# Altium schematic sheet VIDEO.SchDoc: OCULUS RIFT DEVELOPMENT KIT 2 (DK2) MAIN BOARD
size B; Date: 12 MAR 2014; Author: L. BAINBRIDGE; CompanyName: Oculus VR, Inc.; DrawnBy: L. BAINBRIDGE; Engineer: L. BAINBRIDGE; Organization: Oculus VR, Inc.; DocumentNumber: 1; Revision: 3.3; SheetNumber: 1; SheetTotal: 6; PageSetup: Record=PageOptions|CenterHorizontal=True|CenterVertical=True|PrintScale=1.12|XCorrection=1.00|YCorrection=1.00|PrintKind=1|BorderSize=5000000|LeftOffset=0|BottomOffset=0|Orientation=2|PaperLength=1000|PaperWidth=1000|Scale=100|PaperSource=15|PrintQuality=1200|MediaType=1|DitherType=0|PaperKind=11 x 17|PrintScaleMode=1; SheetDescription: VIDEO HDMI RX TO MIPI DSI TX BRIDGE AND SUPPORTING CIRCUITS; PartNumber: N/A; ProjectName: DK2
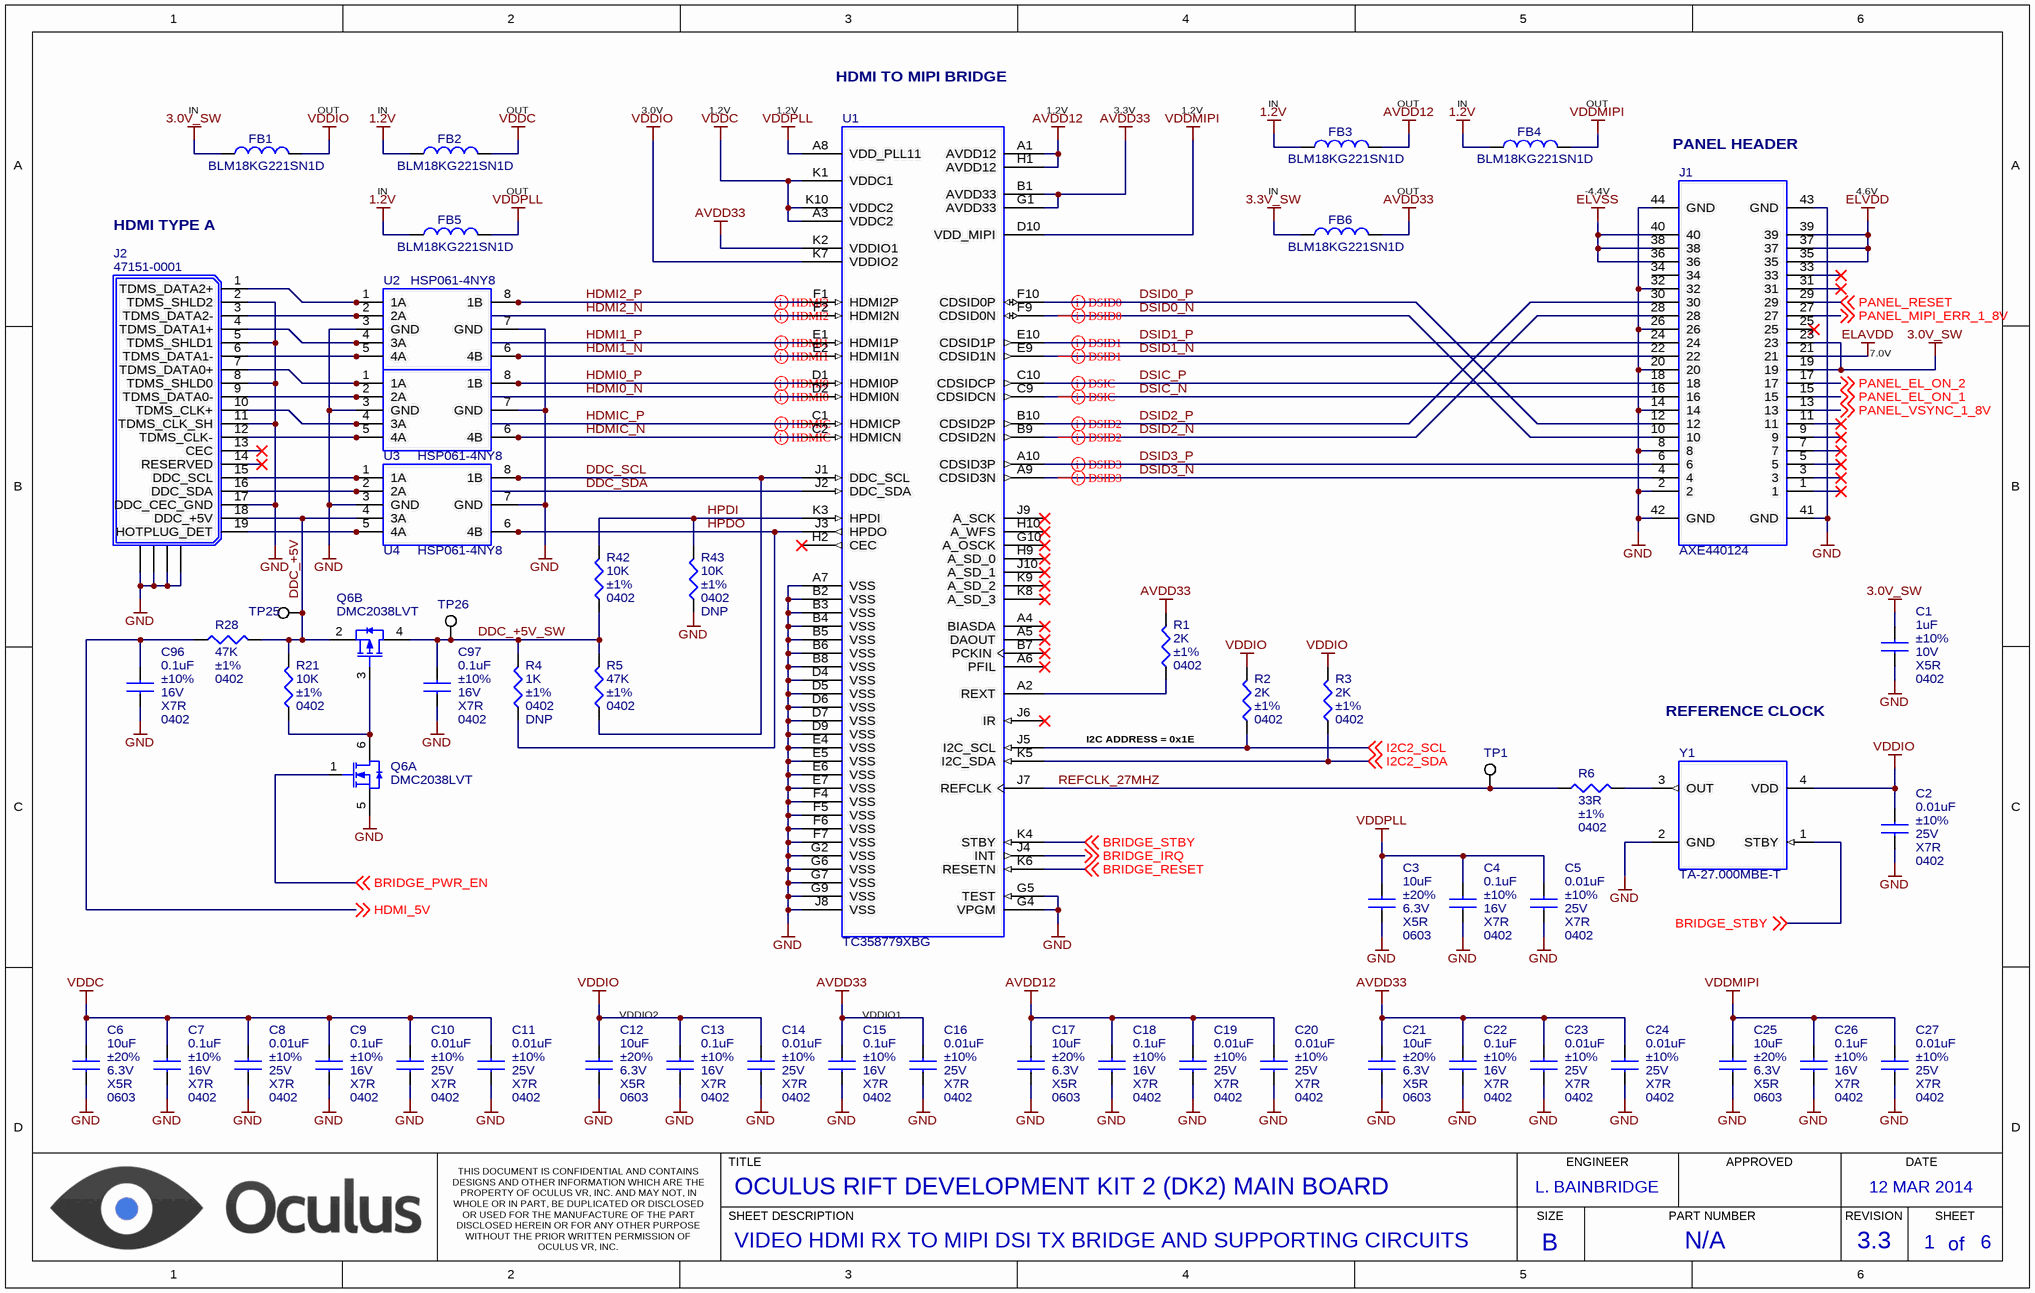
[diagram p0: VIDEO.SchDoc]

## Parts
C1  1uF  Tolerance: ±10%  Voltage: 10V  Dielectric: X5R  Package: 0402  [CAP_CERAMIC_0402]
C2  0.01uF  Tolerance: ±10%  Voltage: 25V  Dielectric: X7R  Package: 0402  [CAP_CERAMIC_0402]
C3  10uF  Tolerance: ±20%  Voltage: 6.3V  Dielectric: X5R  Package: 0603  [CAP_CERAMIC_0603]
C4  0.1uF  Tolerance: ±10%  Voltage: 16V  Dielectric: X7R  Package: 0402  [CAP_CERAMIC_0402]
C5  0.01uF  Tolerance: ±10%  Voltage: 25V  Dielectric: X7R  Package: 0402  [CAP_CERAMIC_0402]
C6  10uF  Tolerance: ±20%  Voltage: 6.3V  Dielectric: X5R  Package: 0603  [CAP_CERAMIC_0603]
C7  0.1uF  Tolerance: ±10%  Voltage: 16V  Dielectric: X7R  Package: 0402  [CAP_CERAMIC_0402]
C8  0.01uF  Tolerance: ±10%  Voltage: 25V  Dielectric: X7R  Package: 0402  [CAP_CERAMIC_0402]
C9  0.1uF  Tolerance: ±10%  Voltage: 16V  Dielectric: X7R  Package: 0402  [CAP_CERAMIC_0402]
C10  0.01uF  Tolerance: ±10%  Voltage: 25V  Dielectric: X7R  Package: 0402  [CAP_CERAMIC_0402]
C11  0.01uF  Tolerance: ±10%  Voltage: 25V  Dielectric: X7R  Package: 0402  [CAP_CERAMIC_0402]
C12  10uF  Tolerance: ±20%  Voltage: 6.3V  Dielectric: X5R  Package: 0603  [CAP_CERAMIC_0603]
C13  0.1uF  Tolerance: ±10%  Voltage: 16V  Dielectric: X7R  Package: 0402  [CAP_CERAMIC_0402]
C14  0.01uF  Tolerance: ±10%  Voltage: 25V  Dielectric: X7R  Package: 0402  [CAP_CERAMIC_0402]
C15  0.1uF  Tolerance: ±10%  Voltage: 16V  Dielectric: X7R  Package: 0402  [CAP_CERAMIC_0402]
C16  0.01uF  Tolerance: ±10%  Voltage: 25V  Dielectric: X7R  Package: 0402  [CAP_CERAMIC_0402]
C17  10uF  Tolerance: ±20%  Voltage: 6.3V  Dielectric: X5R  Package: 0603  [CAP_CERAMIC_0603]
C18  0.1uF  Tolerance: ±10%  Voltage: 16V  Dielectric: X7R  Package: 0402  [CAP_CERAMIC_0402]
C19  0.01uF  Tolerance: ±10%  Voltage: 25V  Dielectric: X7R  Package: 0402  [CAP_CERAMIC_0402]
C20  0.01uF  Tolerance: ±10%  Voltage: 25V  Dielectric: X7R  Package: 0402  [CAP_CERAMIC_0402]
C21  10uF  Tolerance: ±20%  Voltage: 6.3V  Dielectric: X5R  Package: 0603  [CAP_CERAMIC_0603]
C22  0.1uF  Tolerance: ±10%  Voltage: 16V  Dielectric: X7R  Package: 0402  [CAP_CERAMIC_0402]
C23  0.01uF  Tolerance: ±10%  Voltage: 25V  Dielectric: X7R  Package: 0402  [CAP_CERAMIC_0402]
C24  0.01uF  Tolerance: ±10%  Voltage: 25V  Dielectric: X7R  Package: 0402  [CAP_CERAMIC_0402]
C25  10uF  Tolerance: ±20%  Voltage: 6.3V  Dielectric: X5R  Package: 0603  [CAP_CERAMIC_0603]
C26  0.1uF  Tolerance: ±10%  Voltage: 16V  Dielectric: X7R  Package: 0402  [CAP_CERAMIC_0402]
C27  0.01uF  Tolerance: ±10%  Voltage: 25V  Dielectric: X7R  Package: 0402  [CAP_CERAMIC_0402]
C96  0.1uF  Tolerance: ±10%  Voltage: 16V  Dielectric: X7R  Package: 0402  [CAP_CERAMIC_0402]
C97  0.1uF  Tolerance: ±10%  Voltage: 16V  Dielectric: X7R  Package: 0402  [CAP_CERAMIC_0402]
FB1  BLM18KG221SN1D  [INDUCTOR_0603]
FB2  BLM18KG221SN1D  [INDUCTOR_0603]
FB3  BLM18KG221SN1D  [INDUCTOR_0603]
FB4  BLM18KG221SN1D  [INDUCTOR_0603]
FB5  BLM18KG221SN1D  [INDUCTOR_0603]
FB6  BLM18KG221SN1D  [INDUCTOR_0603]
J1  AXE440124  [AXE440124]
J2  47151-0001  [47151-0001]
Q6  DMC2038LVT  [TSOT26]  (parts A,B of 2)
R1  2K  Package: 0402  Tolerance: ±1%  [RESISTOR_0402]
R2  2K  Package: 0402  Tolerance: ±1%  [RESISTOR_0402]
R3  2K  Package: 0402  Tolerance: ±1%  [RESISTOR_0402]
R4  1K  Package: 0402  Tolerance: ±1%  [RESISTOR_0402]  (no BOM)
R5  47K  Package: 0402  Tolerance: ±1%  [RESISTOR_0402]
R6  33R  Package: 0402  Tolerance: ±1%  [RESISTOR_0402]
R21  10K  Package: 0402  Tolerance: ±1%  [RESISTOR_0402]
R28  47K  Package: 0402  Tolerance: ±1%  [RESISTOR_0402]
R42  10K  Package: 0402  Tolerance: ±1%  [RESISTOR_0402]
R43  10K  Package: 0402  Tolerance: ±1%  [RESISTOR_0402]  (no BOM)
TP1  TEST POINT  [TEST_POINT_PAD_1MM]  (value not drawn)  (no BOM)
TP25  TEST POINT  [TEST_POINT_PAD_1MM]  (value not drawn)  (no BOM)
TP26  TEST POINT  [TEST_POINT_PAD_1MM]  (value not drawn)  (no BOM)
U1  TC358779XBG  [BGA80]
U2  HSP061-4NY8  [HSP061-4NY8]
U3  HSP061-4NY8  [HSP061-4NY8]
U4  HSP061-4NY8  [HSP061-4NY8]
Y1  TA-27.000MBE-T  [TXC_TD]

## Nets
1.2V: FB2.1 FB3.1 FB4.1 FB5.1
3.0V_SW: C1.1 FB1.1 J1.19 J1.23
3.3V_SW: FB6.1
AVDD12: C17.1 C18.1 C19.1 C20.1 FB3.2 U1.A1(AVDD12) U1.H1(AVDD12)
AVDD33: C15.1 C16.1 C21.1 C22.1 C23.1 C24.1 FB6.2 R1.2 U1.B1(AVDD33) U1.G1(AVDD33) U1.K2(VDDIO1)
ELAVDD: J1.21
ELVDD: J1.35 J1.37 J1.39
ELVSS: J1.36 J1.38 J1.40
GND: C1.2 C2.2 C3.2 C4.2 C5.2 C6.2 C7.2 C8.2 C9.2 C10.2 C11.2 C12.2 C13.2 C14.2 C15.2 C16.2 C17.2 C18.2 C19.2 C20.2 C21.2 C22.2 C23.2 C24.2 C25.2 C26.2 C27.2 C96.2 C97.2 J1.2 J1.8 J1.14 J1.20 J1.26 J1.32 J1.41(GND) J1.42(GND) J1.43(GND) J1.44(GND) J2.2(TDMS_SHLD2) J2.5(TDMS_SHLD1) J2.8(TDMS_SHLD0) J2.11(TDMS_CLK_SH) J2.17(DDC_CEC_GND) J2.20(SHIELD) J2.21(SHIELD) J2.22(SHIELD) J2.23(SHIELD) Q6.5(S) R43.1 U1.A7(VSS) U1.B2(VSS) U1.B3(VSS) U1.B4(VSS) U1.B5(VSS) U1.B6(VSS) U1.B8(VSS) U1.D4(VSS) U1.D5(VSS) U1.D6(VSS) U1.D7(VSS) U1.D9(VSS) U1.E4(VSS) U1.E5(VSS) U1.E6(VSS) U1.E7(VSS) U1.F4(VSS) U1.F5(VSS) U1.F6(VSS) U1.F7(VSS) U1.G2(VSS) U1.G4(VPGM) U1.G5(TEST) U1.G6(VSS) U1.G7(VSS) U1.G9(VSS) U1.J8(VSS) U2.3(GND) U2.7(GND) U3.3(GND) U3.7(GND) U4.3(GND) U4.7(GND) Y1.2(GND)
VDDC: C6.1 C7.1 C8.1 C9.1 C10.1 C11.1 FB2.2 U1.A3(VDDC2) U1.K1(VDDC1) U1.K10(VDDC2)
VDDIO: C2.1 C12.1 C13.1 C14.1 FB1.2 R2.2 R3.2 U1.K7(VDDIO2) Y1.4(VDD)
VDDMIPI: C25.1 C26.1 C27.1 FB4.2 U1.D10(VDD_MIPI)
VDDPLL: C3.1 C4.1 C5.1 FB5.2 U1.A8(VDD_PLL11)
BRIDGE_IRQ: U1.J4(INT) ; off-sheet BRIDGE_IRQ
BRIDGE_PWR_EN: Q6.1(G) ; off-sheet BRIDGE_PWR_EN
BRIDGE_RESET: U1.K6(RESETN) ; off-sheet BRIDGE_RESET
BRIDGE_STBY: U1.K4(STBY) Y1.1(STBY) ; off-sheet BRIDGE_STBY
DDC_+5V: J2.18(DDC_+5V) Q6.2(S) R21.2 R28.2 TP25.1 U4.4(3A)
DDC_+5V_SW: C97.1 Q6.4(D) R4.2 R5.2 R42.1 TP26.1
DDC_SCL: J2.15(DDC_SCL) R5.1 U1.J1(DDC_SCL) U4.1(1A) U4.8(1B)
DDC_SDA: J2.16(DDC_SDA) U1.J2(DDC_SDA) U4.2(2A)
DSIC_N: J1.16 U1.C9(CDSIDCN)
DSIC_P: J1.18 U1.C10(CDSIDCP)
DSID0_N: J1.10 U1.F9(CDSID0N)
DSID0_P: J1.12 U1.F10(CDSID0P)
DSID1_N: J1.22 U1.E9(CDSID1N)
DSID1_P: J1.24 U1.E10(CDSID1P)
DSID2_N: J1.28 U1.B9(CDSID2N)
DSID2_P: J1.30 U1.B10(CDSID2P)
DSID3_N: J1.4 U1.A9(CDSID3N)
DSID3_P: J1.6 U1.A10(CDSID3P)
HDMI0_N: J2.9(TDMS_DATA0-) U1.D2(HDMI0N) U3.2(2A)
HDMI0_P: J2.7(TDMS_DATA0+) U1.D1(HDMI0P) U3.1(1A) U3.8(1B)
HDMI1_N: J2.6(TDMS_DATA1-) U1.E2(HDMI1N) U2.5(4A) U2.6(4B)
HDMI1_P: J2.4(TDMS_DATA1+) U1.E1(HDMI1P) U2.4(3A)
HDMI2_N: J2.3(TDMS_DATA2-) U1.F2(HDMI2N) U2.2(2A)
HDMI2_P: J2.1(TDMS_DATA2+) U1.F1(HDMI2P) U2.1(1A) U2.8(1B)
HDMI_5V: C96.1 R28.1 ; off-sheet HDMI_5V
HDMIC_N: J2.12(TDMS_CLK-) U1.C2(HDMICN) U3.5(4A) U3.6(4B)
HDMIC_P: J2.10(TDMS_CLK+) U1.C1(HDMICP) U3.4(3A)
HPDI: R42.2 R43.2 U1.K3(HPDI)
HPDO: J2.19(HOTPLUG_DET) R4.1 U1.J3(HPDO) U4.5(4A) U4.6(4B)
I2C2_SCL: R2.1 U1.J5(I2C_SCL) ; off-sheet I2C2_SCL
I2C2_SDA: R3.1 U1.K5(I2C_SDA) ; off-sheet I2C2_SDA
PANEL_EL_ON_1: J1.15 ; off-sheet PANEL_EL_ON_1
PANEL_EL_ON_2: J1.17 ; off-sheet PANEL_EL_ON_2
PANEL_MIPI_ERR_1_8V: J1.27 ; off-sheet PANEL_MIPI_ERR_1_8V
PANEL_RESET: J1.29 ; off-sheet PANEL_RESET
PANEL_VSYNC_1_8V: J1.13 ; off-sheet PANEL_VSYNC_1_8V
REFCLK_27MHZ: R6.1 TP1.1 U1.J7(REFCLK)
NetQ6_3: Q6.3(G) Q6.6(D) R21.1
NetR1_1: R1.1 U1.A2(REXT)
NetR6_2: R6.2 Y1.3(OUT)

Not connected (* = marked no-connect by the designer): J1 1* 3* 5* 7* 9* 11* 25* 31* 33* 34; J2 13(CEC)* 14(RESERVED)*; U1 A4(BIASDA)* A5(DAOUT)* A6(PFIL)* B7(PCKIN)* G10(A_OSCK)* H2(CEC)* H9(A_SD_0)* H10(A_WFS)* J6(IR)* J9(A_SCK)* J10(A_SD_1)* K8(A_SD_3)* K9(A_SD_2)*

## Layout directives
differential pair: DSIC_N, DSIC_P, DSID0_N, DSID0_P, DSID1_N, DSID1_P, DSID2_N, DSID2_P, DSID3_N, DSID3_P, HDMI0_N, HDMI0_P, HDMI1_N, HDMI1_P, HDMI2_N, HDMI2_P, HDMIC_N, HDMIC_P

## Notes on the sheet
- HDMI TO MIPI BRIDGE
- (near FB3) IN
- (near FB3) OUT
- (near FB4) IN
- (near FB4) OUT
- (near FB1) IN
- (near FB1) OUT
- (near FB2) IN
- (near FB2) OUT
- 3.0V
- 1.2V
- 3.3V
- PANEL HEADER
- HDMI TYPE A
- IN
- OUT
- -4.4V
- 4.6V
- 7.0V
- (near R2) I2C ADDRESS = 0x1E
- REFERENCE CLOCK
- VDDIO2
- VDDIO1
- TITLE
- ENGINEER
- APPROVED
- DATE
- THIS DOCUMENT IS CONFIDENTIAL AND CONTAINS DESIGNS AND OTHER INFORMATION WHICH ARE THE PROPERTY OF OCULUS VR, INC. AND MAY NOT, IN WHOLE OR IN PART, BE DUPLICATED OR DISCLOSED OR USED FOR THE MANUFACTURE OF THE PART DISCLOSED HEREIN OR FOR ANY OTHER PURPOSE WITHOUT THE PRIOR WRITTEN PERMISSION OF OCULUS VR, INC.
- SHEET DESCRIPTION
- SIZE
- PART NUMBER
- REVISION
- SHEET
- of
- B

## Library data of the parts
C1 = CAP, CERAMIC: CAP, CERAMIC, 1uF, ±10%, 10V, X5R, 0402; Manufacturer: MURATA ELECTRONICS; Part Number: GRM155R61A105KE15D
C2 C5 C8 C10 C11 C14 C16 C19 C20 C23 C24 C27 = CAP, CERAMIC: CAP, CERAMIC, 0.01uF, ±10%, 25V, X7R, 0402; Manufacturer: MURATA ELECTRONICS; Part Number: GRM155R71E103KA01D
C3 C6 C12 C17 C21 C25 = CAP, CERAMIC: CAP, CERAMIC, 10uF, ±20%, 6.3V, X5R, 0603; Manufacturer: MURATA ELECTRONICS; Part Number: GRM188R60J106ME47D
C4 C7 C9 C13 C15 C18 C22 C26 C96 C97 = CAP, CERAMIC: CAP, CERAMIC, 0.1uF, ±10%, 16V, X7R, 0402; Manufacturer: MURATA ELECTRONICS; Part Number: GRM155R71C104KA88D
FB1-FB6 = INDUCTOR: FERRITE CHIP BEAD, 220 OHM @ 100MHz, 2.2A, 0603; Manufacturer: MURATA ELECTRONICS; Part Number: BLM18KG221SN1D; Package: 0603; Impedance: 220 ohm @ 100MHz
J1 = AXE440124: CONNECTOR, 40-PIN HEADER, 0.4MM PITCH; Manufacturer: PANASONIC; Part Number: AXE440124; Verified Pinout: *
J2 = 47151-0001: CONNECTOR, HDMI TYPE A, R/A, SMD; Manufacturer: MOLEX; Part Number: 47151-0001
Q6 = DMC2038LVT: FET, COMPLEMENTARY, LOGIC LEVEL; Manufacturer: DIODES INC; Part Number: DMC2038LVT
R1-R3 = RESISTOR: RES, 2K OHM, 1/10W, ±1%, 0402; Manufacturer: PANASONIC; Part Number: ERJ-2RKF2001X; Power Rating: 1/10W
R4 = RESISTOR: RES, 1K OHM, 1/10W, ±1%, 0402; Manufacturer: PANASONIC; Part Number: ERJ-2RKF1001X; Power Rating: 1/10W; DNP: DNP
R5 R28 = RESISTOR: RES, 47K OHM, 1/10W, ±1%, 0402; Manufacturer: PANASONIC; Part Number: ERJ-2RKF4702X; Power Rating: 1/10W
R6 = RESISTOR: RES, 33 OHM, 1/10W, ±1%, 0402; Manufacturer: PANASONIC; Part Number: ERJ-2RKF33R0X; Power Rating: 1/10W
R21 R42 R43 = RESISTOR: RES, 10K OHM, 1/10W, ±1%, 0402; Manufacturer: PANASONIC; Part Number: ERJ-2RKF1002X; Power Rating: 1/10W
  R43: DNP: DNP
TP1 TP25 TP26 = TEST_POINT_GENERIC: Manufacturer: *; Part Number: *
U1 = TC358779XBG: IC, HDMI RX TO MIPI DSI TX BRIDGE; Manufacturer: TOSHIBA; Part Number: TC358779XBG; Verified Pinout: *
U2-U4 = HSP061-4NY8: IC, 4-LINE ESD PROTECTION ARRAY, HIGH SPEED; Manufacturer: STMICROELECTRONICS; Part Number: HSP061-4NY8; Verified Pinout: *
Y1 = TA-27.000MBE-T: OSCILLATOR, 27MHz, MEMS, 3.3V, 50PPM; Manufacturer: TXC; Part Number: TA-27.000MBE-T; Verified Pinout: *